# Altium schematic sheet STM32.SchDoc
size A; SheetNumber: 4; SheetTotal: 7
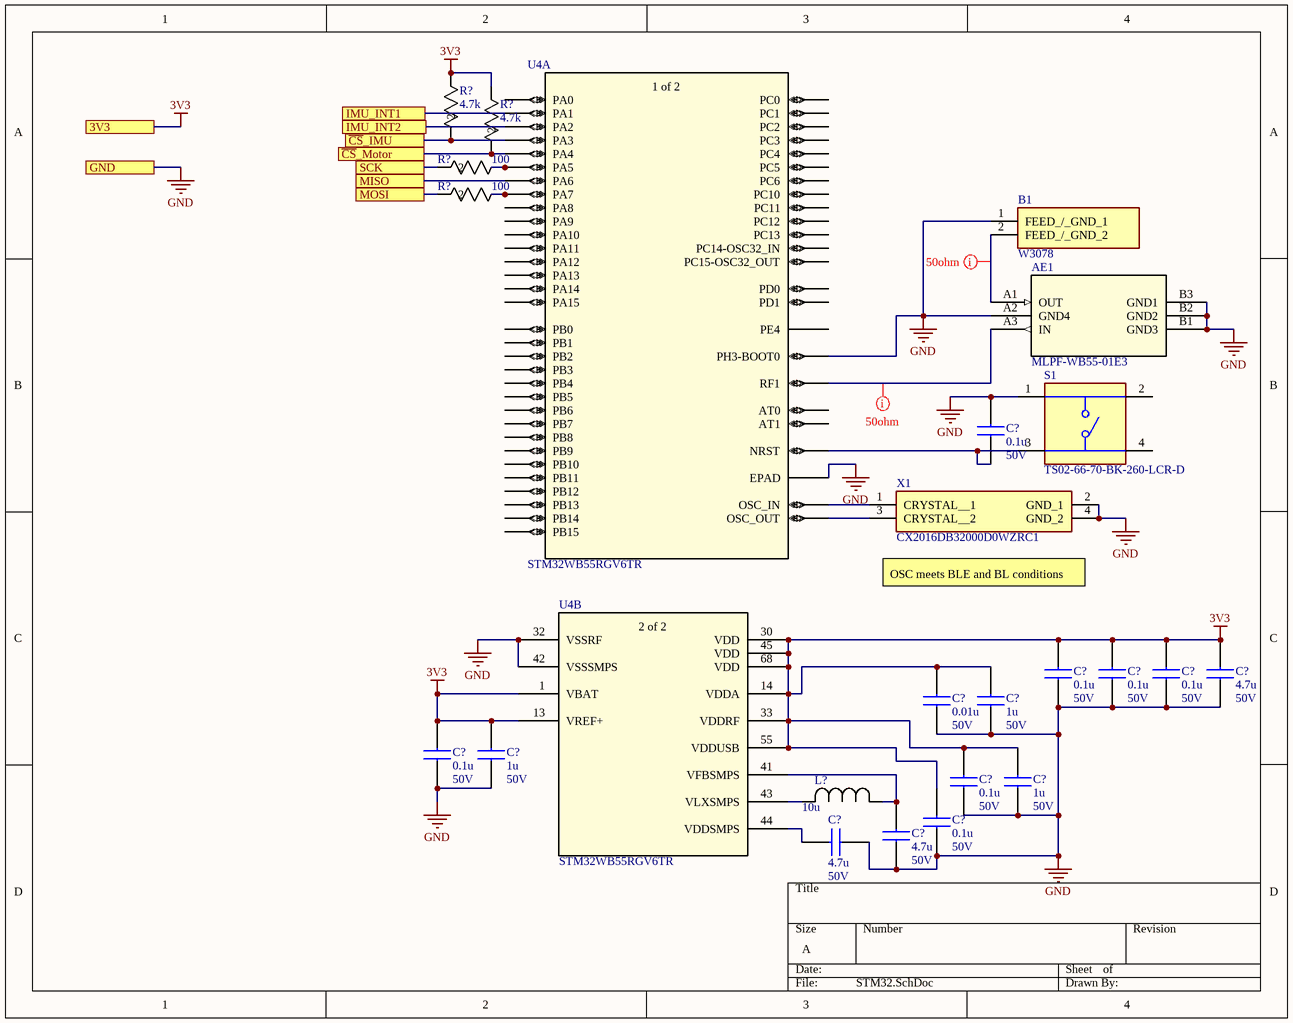
[diagram p0: STM32.SchDoc]

## Parts
(Parts that share a designator on the sheet are numbered #1, #2 ... from top to bottom, then left to right.)
AE1  MLPF-WB55-01E3  [MLPF-WB55-01E3_STM]
B1  W3078  [W3078]
C?#1  value 0.1u  Rated Voltage: 50V  [CAPC2012X145N]  (hidden comment: KAM21BR71H104JM)
C?#2  value 0.1u  Rated Voltage: 50V  [CAPC2012X145N]  (hidden comment: KAM21BR71H104JM)
C?#3  value 0.1u  Rated Voltage: 50V  [CAPC2012X145N]  (hidden comment: KAM21BR71H104JM)
C?#4  value 0.1u  Rated Voltage: 50V  [CAPC2012X145N]  (hidden comment: KAM21BR71H104JM)
C?#5  value 4.7u  Rated Voltage: 50V  [CAPC2012X145N]  (hidden comment: C2012X5R1H475M125AB)
C?#6  value 0.01u  Rated Voltage: 50V  [CAPC2012X145N]  (hidden comment: KAM21BR71H103KT)
C?#7  value 1u  Rated Voltage: 50V  [CAPC2012X145N]  (hidden comment: KGM21AR51H105KU)
C?#8  value 0.1u  Rated Voltage: 50V  [CAPC2012X145N]  (hidden comment: KAM21BR71H104JM)
C?#9  value 1u  Rated Voltage: 50V  [CAPC2012X145N]  (hidden comment: KGM21AR51H105KU)
C?#10  value 0.1u  Rated Voltage: 50V  [CAPC2012X145N]  (hidden comment: KAM21BR71H104JM)
C?#11  value 1u  Rated Voltage: 50V  [CAPC2012X145N]  (hidden comment: KGM21AR51H105KU)
C?#12  value 4.7u  Rated Voltage: 50V  [CAPC2012X145N]  (hidden comment: C2012X5R1H475M125AB)
C?#13  value 0.1u  Rated Voltage: 50V  [CAPC2012X145N]  (hidden comment: KAM21BR71H104JM)
C?#14  value 4.7u  Rated Voltage: 50V  [CAPC2012X145N]  (hidden comment: C2012X5R1H475M125AB)
L?  value 10u  [IND_LQM21FN100M80L_MUR]  (hidden comment: LQM21FN100M80L)
R?#1  value 4.7k  [RC0805N_YAG]  (hidden comment: RC0805JR-074K7L)
R?#2  value 4.7k  [RC0805N_YAG]  (hidden comment: RC0805JR-074K7L)
R?#3  value 100  [RC0805N_YAG]  (hidden comment: RC0805JR-07100RL)
R?#4  value 100  [RC0805N_YAG]  (hidden comment: RC0805JR-07100RL)
S1  TS02-66-70-BK-260-LCR-D  [SW_TS02-66-70-BK-260-LCR-D]
U4  STM32WB55RGV6TR  [VFQFN68-8x8mm]  (parts A,B of 2)
X1  CX2016DB32000D0WZRC1  [CX2016DB32000D0WZRC1]

## Ports
3V3, GND, IMU_INT1, IMU_INT2, MISO, MOSI, SCK, ~{CS}_IMU, ~{CS}_Motor

## Nets
3V3: C?#2.2 C?#3.2 C?#4.2 C?#5.2 C?#6.2 C?#7.2 C?#8.2 C?#9.2 C?#10.2 C?#11.2 C?#13.2 R?#1.1 R?#2.1 U4.1(VBAT) U4.13(VREF+) U4.14(VDDA) U4.30(VDD) U4.33(VDDRF) U4.45(VDD) U4.55(VDDUSB) U4.68(VDD) ; port 3V3
GND: AE1.A2(GND4) AE1.B1(GND3) AE1.B2(GND2) AE1.B3(GND1) B1.1(FEED_/_GND_1) C?#1.2 C?#2.1 C?#3.1 C?#4.1 C?#5.1 C?#6.1 C?#7.1 C?#8.1 C?#9.1 C?#10.1 C?#11.1 C?#12.1 C?#13.1 C?#14.1 S1.1 U4.5(PH3-BOOT0) U4.32(VSSRF) U4.42(VSSSMPS) U4.69(EPAD) X1.2(GND_1) X1.4(GND_2) ; port GND
~{CS}_IMU: R?#1.2 U4.18(PA3) ; port ~{CS}_IMU
~{CS}_Motor: R?#2.2 U4.19(PA4) ; port ~{CS}_Motor
IMU_INT1: U4.16(PA1) ; port IMU_INT1
IMU_INT2: U4.17(PA2) ; port IMU_INT2
MISO: U4.21(PA6) ; port MISO
MOSI: R?#4.2 ; port MOSI
SCK: R?#3.2 ; port SCK
NetAE1_A1: AE1.A1(OUT) B1.2(FEED_/_GND_2)
NetAE1_A3: AE1.A3(IN) U4.31(RF1)
NetC?#1_1: C?#1.1 S1.3 U4.8(NRST)
NetC?#12_2: C?#12.2 U4.44(VDDSMPS)
NetC?#14_2: C?#14.2 L?.1 U4.41(VFBSMPS)
NetL?_2: L?.2 U4.43(VLXSMPS)
NetR?#3_1: R?#3.1 U4.20(PA5)
NetR?#4_1: R?#4.1 U4.22(PA7)
NetU4_34: U4.34(OSC_OUT) X1.3(CRYSTAL__2)
NetU4_35: U4.35(OSC_IN) X1.1(CRYSTAL__1)

Not connected (* = marked no-connect by the designer): S1 2 4; U4 2(PC13) 3(PC14-OSC32_IN) 4(PC15-OSC32_OUT) 6(PB8) 7(PB9) 9(PC0) 10(PC1) 11(PC2) 12(PC3) 15(PA0) 23(PA8) 24(PA9) 25(PC4) 26(PC5) 27(PB2) 28(PB10) 29(PB11) 36(AT0) 37(AT1) 38(PB0) 39(PB1) 40(PE4) 46(PB12) 47(PB13) 48(PB14) 49(PB15) 50(PC6) 51(PA10) 52(PA11) 53(PA12) 54(PA13) 56(PA14) 57(PA15) 58(PC10) 59(PC11) 60(PC12) 61(PD0) 62(PD1) 63(PB3) 64(PB4) 65(PB5) 66(PB6) 67(PB7)

## Layout directives
mark named 50ohm: NetAE1_A1, NetAE1_A3

## Notes on the sheet
- (near X1) OSC meets BLE and BL conditions
- (in symbol STM32WB55RGV6TR, part A) 1 of 2
- (in symbol STM32WB55RGV6TR, part B) 2 of 2

## Library data of the parts
AE1 = MLPF-WB55-01E3: 2.4 GHz Matched filter companion chip for STM32WB55Cx and STM32WB55Rx; Manufacturer_Name: STMicroelectronics; Copyright: Copyright (C) 2025 Ultra Librarian. All rights reserved.; Manufacturer_Part_Number: MLPF-WB55-01E3; Datasheet: https://www.st.com/resource/en/datasheet/mlpf-wb55-01e3.pdf; RefDes: RefDes; Type: Type
B1 = W3078: Antennas CERAMIC W3078 GC380H N; Manufacturer_Name: PULSE; Geometry.Height: 1.2mm; Mouser Part Number: 673-W3078; Mouser Price/Stock: https://www.mouser.co.uk/ProductDetail/Pulse-Electronics/W3078?qs=k0bvAmZt86CkgrK3%2FGxl6Q%3D%3D; Manufacturer_Part_Number: W3078; Datasheet Link: https://datasheet.datasheetarchive.com/originals/distributors/DKDS-10/182581.pdf
C?#1-C?#4 C?#8 C?#10 C?#13 = KAM21BR71H104JM: Multilayer Ceramic Chip Capacitors, Capacitance=0.1u; Manufacturer_Part_Number: KAM21BR71H104JM
C?#5 C?#12 C?#14 = C2012X5R1H475M125AB: Multilayer Ceramic Chip Capacitors, Capacitance=4.7u; Manufacturer_Part_Number: GCM21BR71H474KA55K
C?#6 = KAM21BR71H103KT: Multilayer Ceramic Chip Capacitors, Capacitance=0.01u; Manufacturer_Part_Number: KAM21BR71H103KT
C?#7 C?#9 C?#11 = KGM21AR51H105KU: Multilayer Ceramic Chip Capacitors, Capacitance=1u; Manufacturer_Part_Number: KGM21AR51H105KU
L? = LQM21FN100M80L: No Description Available; Manufacturer_Name: Murata; Copyright: Copyright (C) 2025 Ultra Librarian. All rights reserved.; Manufacturer_Part_Number: LQM21FN100M80L
R?#1 R?#2 = RC0805JR-074K7L: RES 0805 4.7k 5% 1/8W; Manufacturer_Name: Yageo; Manufacturer_Part_Number: RC0805JR-074K7L; Tolerance: 5%
R?#3 R?#4 = RC0805JR-07100RL: RES 0805 100 5% 1/8W; Manufacturer_Name: Yageo; Manufacturer_Part_Number: RC0805JR-07100RL; Tolerance: 5%
S1 = TS02-66-70-BK-260-LCR-D: 6 x 6 mm, 7 mm Actuator Height, 260 gf, Black, Long Crimped, Through Hole, SPST, Tactile Switch; MF: Same Sky; SnapEDA_Link: https://www.snapeda.com/parts/TS02-66-70-BK-260-LCR-D/Same+Sky/view-part/?ref=snap; Package: None; Value: *; MP: TS02-66-70-BK-260-LCR-D; Check_prices: https://www.snapeda.com/parts/TS02-66-70-BK-260-LCR-D/Same+Sky/view-part/?ref=eda
U4 = STM32WB55RGV6TR: Ultra-low-power dual core Arm Cortex-M4 MCU 64 MHz, Cortex-M0+ 32 MHz with 1 Mbyte of Flash memory, Bluetooth LE 5.4, 802.15.4, Zigbee, Thread, Matter, USB, LCD, AES-256; Manufacturer_Name: STMicroelectronics; Copyright: Copyright (C) 2025 Ultra Librarian. All rights reserved.; Manufacturer_Part_Number: STM32WB55RGV6TR; Datasheet: https://www.st.com/resource/en/datasheet/stm32wb55cc.pdf; RefDes: RefDes; Type: Type
X1 = CX2016DB32000D0WZRC1: 32 MHz +/-25ppm Crystal 8pF 60 Ohms 4-SMD, No Lead; Manufacturer_Name: Kyocera AVX; Geometry.Height: 0.45mm; Mouser Part Number: 581-CX2016DB32DWZRC1; Mouser Price/Stock: https://www.mouser.co.uk/ProductDetail/KYOCERA-AVX/CX2016DB32000D0WZRC1?qs=mHG8nxlouK5LiZGb%2FcBxwg%3D%3D; Manufacturer_Part_Number: CX2016DB32000D0WZRC1; Datasheet Link: https://ele.kyocera.com/assets/products/crystal-device/cx2016db_e.pdf